# EasyEDA schematic LockSwitchSchematicEasyEDA.json
TITLE: Sheet_1; REV: 1.0; Date: 2024-07-08; Sheet: 1/1; Drawn By: Ross Kinard; Company: Your Company
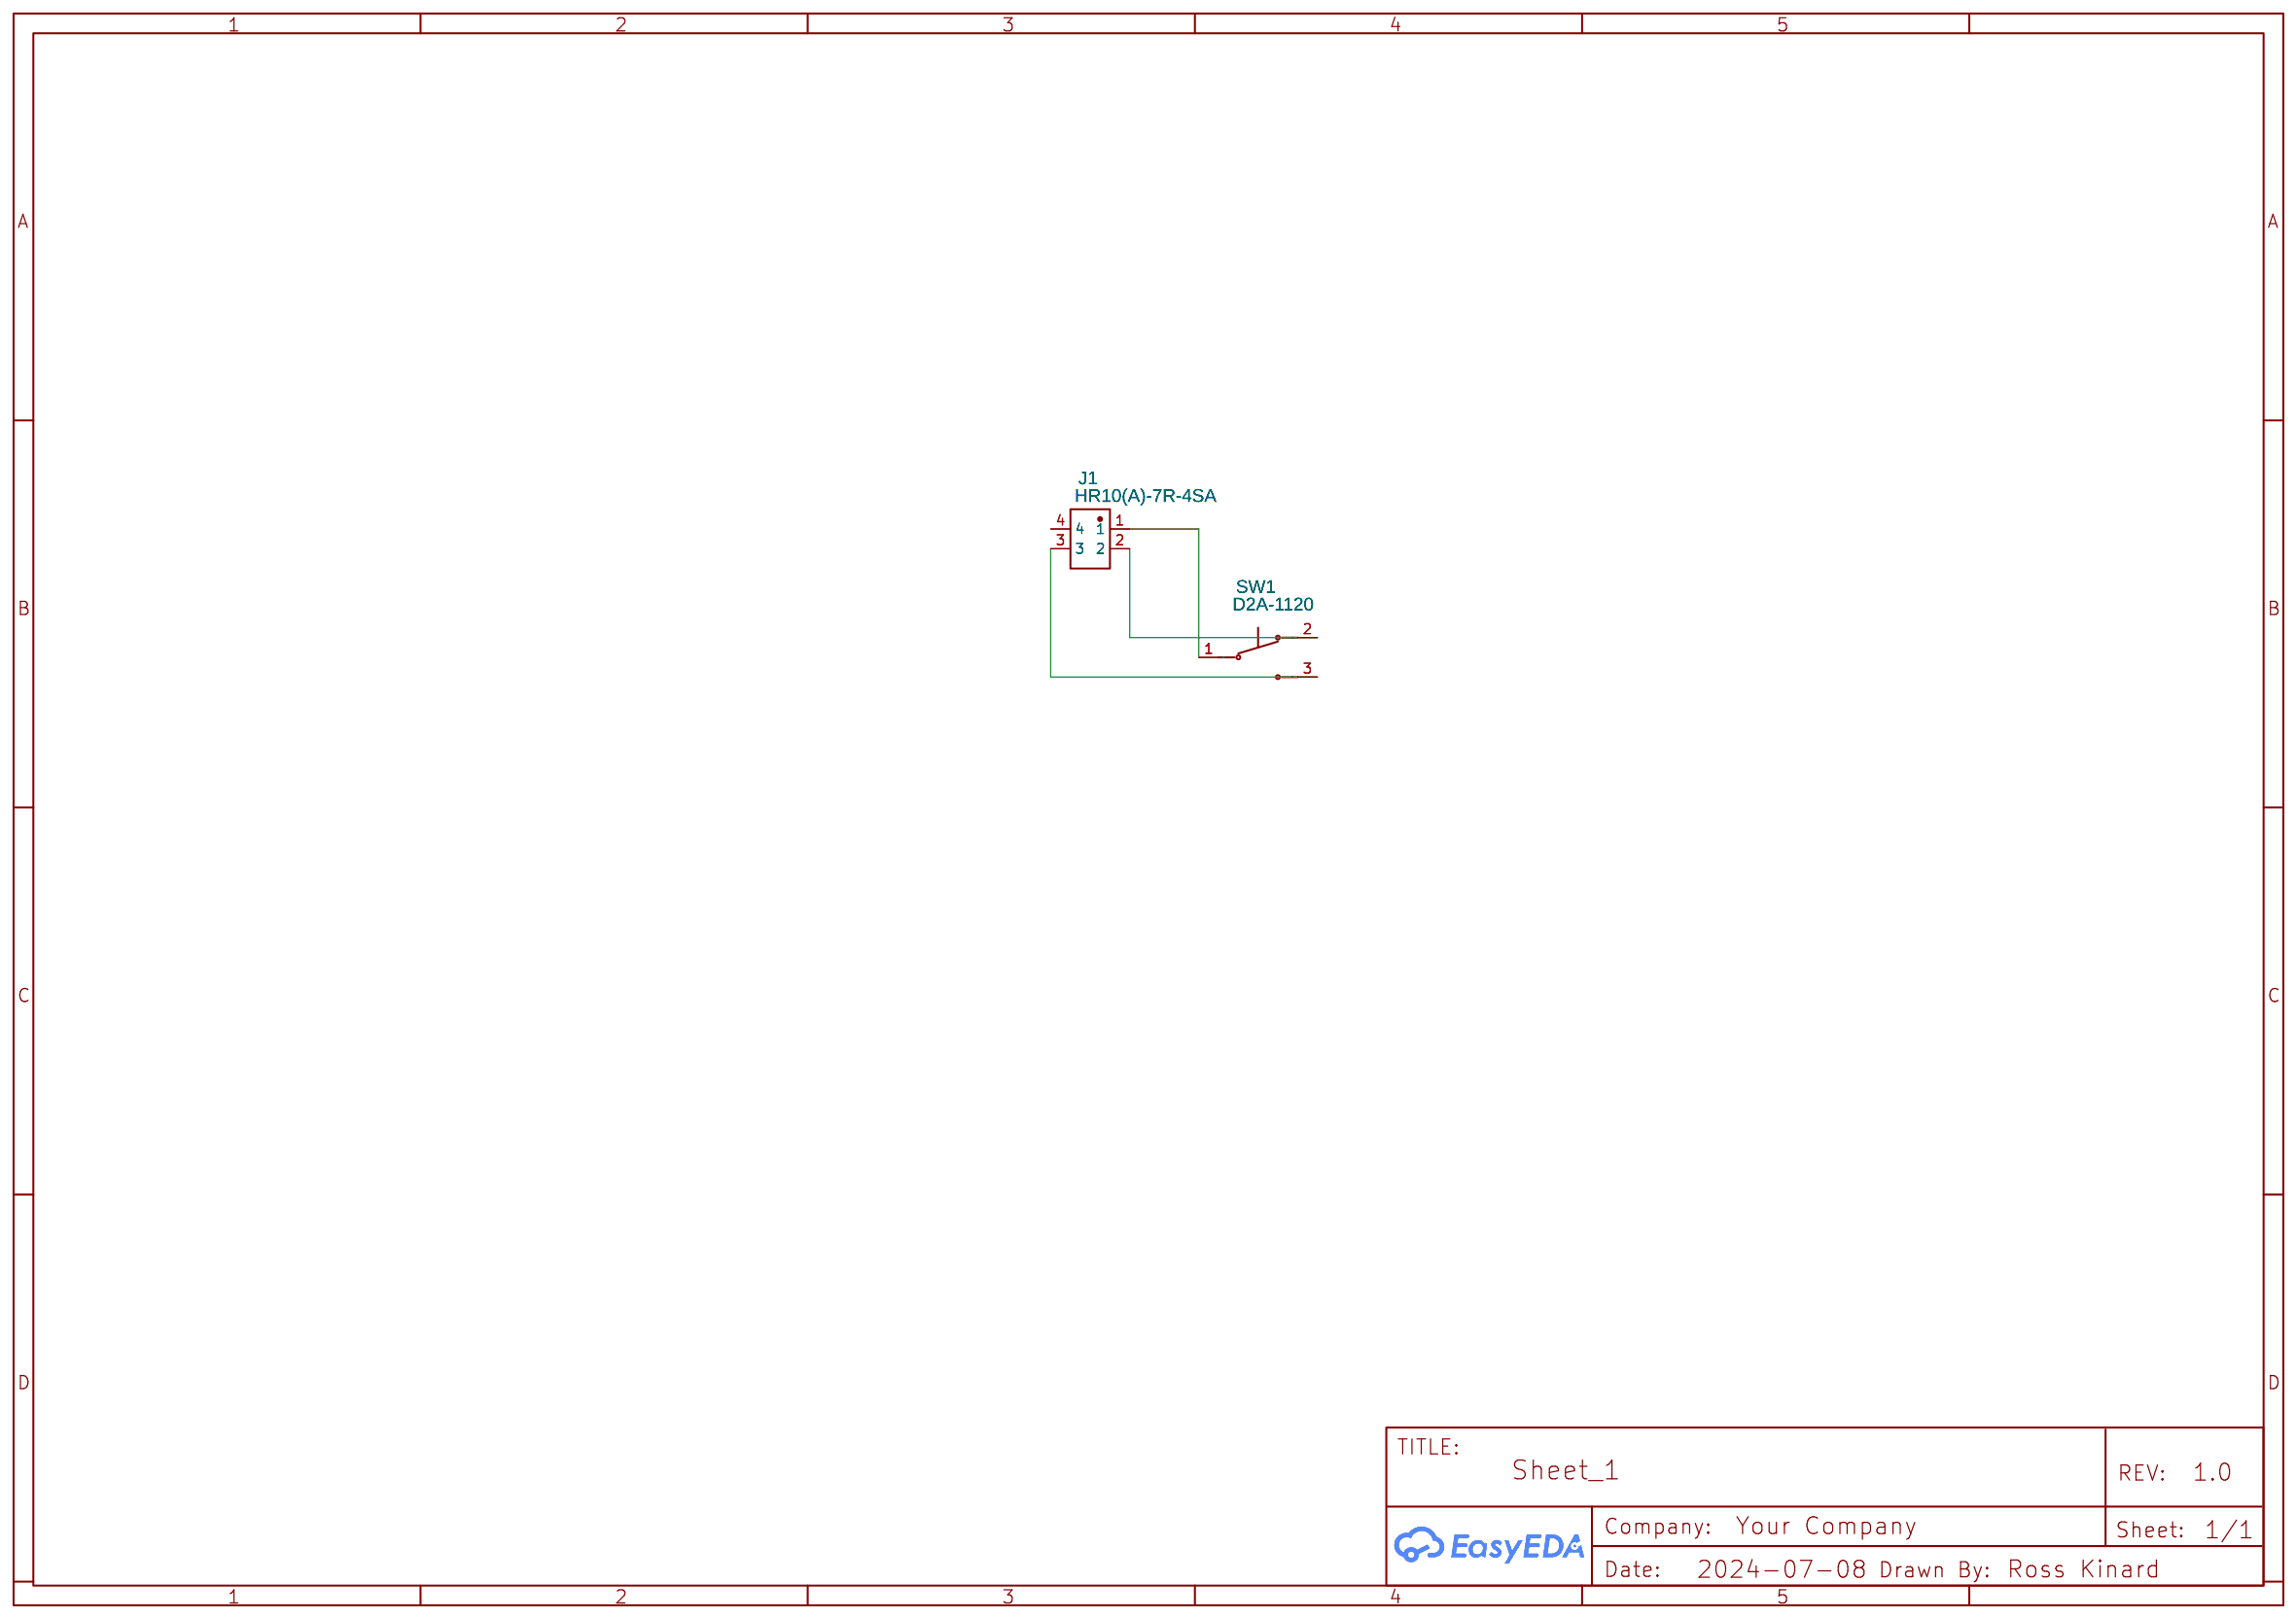
[diagram p0: schematic sheet]

## Parts
J1  HR10(A)-7R-4SA  [CONN-TH_4P-BD11.0-P2.30]
SW1  D2A-1120  [SW-TH_D2A-X1X0]

## Library data of the parts
J1 = HR10(A)-7R-4SA: Contributor: lcsc; Supplier: LCSC; Supplier Part: C9900020271; Manufacturer: null; JLCPCB Part Class: Extended Part
SW1 = D2A-1120: Contributor: lcsc; Supplier: LCSC; Supplier Part: C2734421; Manufacturer: OMRON(欧姆龙); JLCPCB Part Class: Extended Part

## Nets
Net-(J1-1): J1.1 SW1.1(COM)
Net-(J1-2): J1.2 SW1.2(NC)
Net-(J1-3): J1.3 SW1.3(NO)

Not connected (* = marked no-connect by the designer): J1 4
